# EAGLE design motorcontrol (EAGLE 9.6.2)

## Sheet 1 of 2: Logic for motor control.
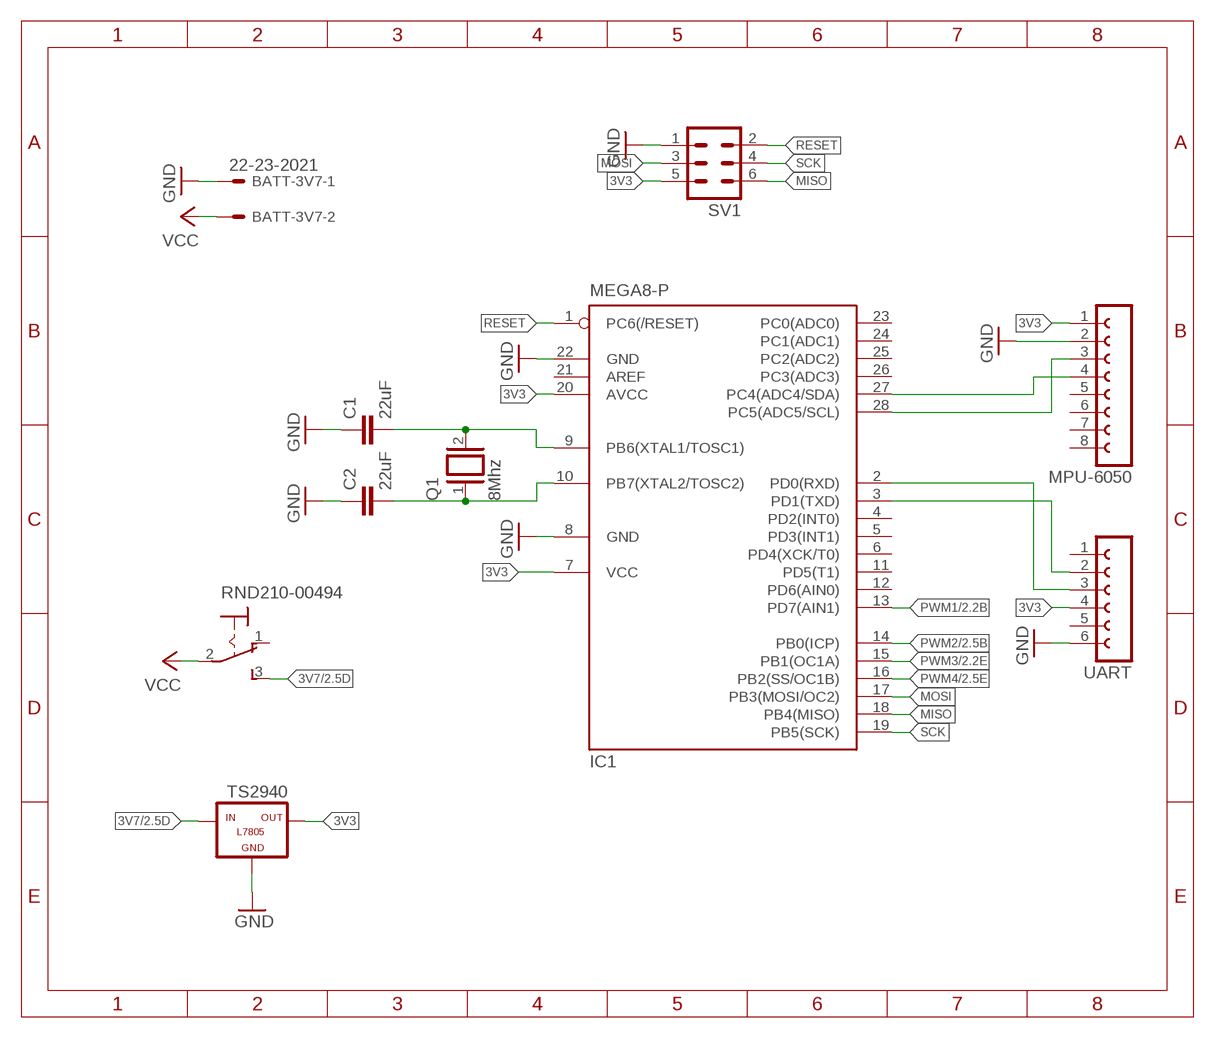
[diagram p0: schematic, sheet 1]

### Parts
BATT-3V7  22-23-2021  [22-23-2021]
C1  22uF  C-EU025-025X050  [C025-025X050]
C2  22uF  C-EU025-025X050  [C025-025X050]
IC1  MEGA8-P  [DIL28-3]
MPU-6050  FE08-1  [FE08]
Q1  8Mhz  XTAL/S  [QS]
RND210-00494  320-916  [320-916]
SV1  MA03-2  [MA03-2]
TS2940  TS2940  [TO220]
UART  FE06-1  [FE06]

### Nets
3V3: IC1.7(VCC) IC1.20(AVCC) MPU-6050.1 SV1.5 TS2940.3(OUT) UART.4
3V7 [Motor]: RND210-00494.3(S) TS2940.1(IN) ; also sheet 2
GND [Motor]: BATT-3V7.1 C1.1 C2.1 IC1.8(GND) IC1.22(GND) MPU-6050.2 SV1.1 TS2940.2(GND) UART.6 ; also sheet 2
MISO: IC1.18(PB4(MISO)) SV1.6
MOSI: IC1.17(PB3(MOSI/OC2)) SV1.3
N$1: C2.2 IC1.10(PB7(XTAL2/TOSC2)) Q1.1
N$2: C1.2 IC1.9(PB6(XTAL1/TOSC1)) Q1.2
N$3: IC1.28(PC5(ADC5/SCL)) MPU-6050.3
N$4: IC1.27(PC4(ADC4/SDA)) MPU-6050.4
N$5: IC1.3(PD1(TXD)) UART.2
N$6: IC1.2(PD0(RXD)) UART.3
PWM1: IC1.13(PD7(AIN1)) ; also sheet 2
PWM2: IC1.14(PB0(ICP)) ; also sheet 2
PWM3: IC1.15(PB1(OC1A)) ; also sheet 2
PWM4: IC1.16(PB2(SS/OC1B)) ; also sheet 2
RESET: IC1.1(PC6(/RESET)) SV1.2
SCK: IC1.19(PB5(SCK)) SV1.4
VCC: BATT-3V7.2 RND210-00494.2(P)
Unconnected: IC1.4(PD2(INT0)) IC1.5(PD3(INT1)) IC1.6(PD4(XCK/T0)) IC1.11(PD5(T1)) IC1.12(PD6(AIN0)) IC1.21(AREF) IC1.23(PC0(ADC0)) IC1.24(PC1(ADC1)) IC1.25(PC2(ADC2)) IC1.26(PC3(ADC3)) MPU-6050.5 MPU-6050.6 MPU-6050.7 MPU-6050.8 RND210-00494.1(O) UART.1 UART.5

## Sheet 2 of 2: Brush motor circuit.
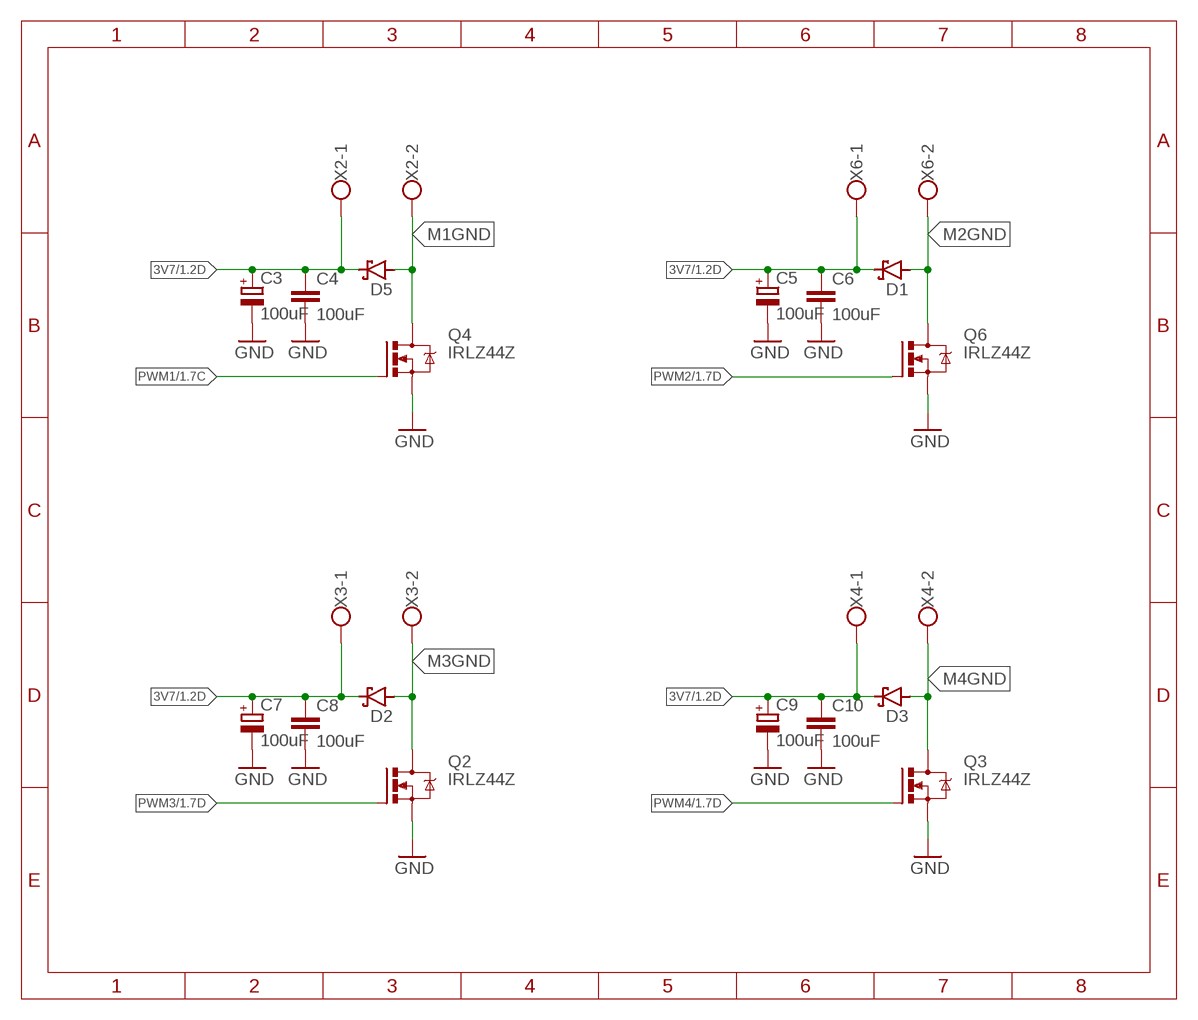
[diagram p1: schematic, sheet 2]

### Parts
C3  100uF  CPOL-EUE2-5  [E2-5]
C4  100uF  C-EU025-025X050  [C025-025X050]
C5  100uF  CPOL-EUE2-5  [E2-5]
C6  100uF  C-EU025-025X050  [C025-025X050]
C7  100uF  CPOL-EUE2-5  [E2-5]
C8  100uF  C-EU025-025X050  [C025-025X050]
C9  100uF  CPOL-EUE2-5  [E2-5]
C10  100uF  C-EU025-025X050  [C025-025X050]
D1  SCHOTTKY-DIODEDO201T15  [DO201T15]
D2  SCHOTTKY-DIODEDO201T15  [DO201T15]
D3  SCHOTTKY-DIODEDO201T15  [DO201T15]
D5  SCHOTTKY-DIODEDO201T15  [DO201T15]
Q2  IRLZ44Z  [TO220BH]
Q3  IRLZ44Z  [TO220BH]
Q4  IRLZ44Z  [TO220BH]
Q6  IRLZ44Z  [TO220BH]
X2  W237-102  [W237-102]
X3  W237-102  [W237-102]
X4  W237-102  [W237-102]
X6  W237-102  [W237-102]

### Nets
3V7 [Motor]: C3.+ C4.1 C5.+ C6.1 C7.+ C8.1 C9.+ C10.1 D1.C D2.C D3.C D5.C X2.1 X3.1 X4.1 X6.1 ; also sheet 1
GND [Motor]: C3.- C4.2 C5.- C6.2 C7.- C8.2 C9.- C10.2 Q2.S Q3.S Q4.S Q6.S ; also sheet 1
M1GND [Motor]: D5.A Q4.D X2.2
M2GND [Motor]: D1.A Q6.D X6.2
M3GND [Motor]: D2.A Q2.D X3.2
M4GND [Motor]: D3.A Q3.D X4.2
PWM1: Q4.G ; also sheet 1
PWM2: Q6.G ; also sheet 1
PWM3: Q2.G ; also sheet 1
PWM4: Q3.G ; also sheet 1

## Library data of the parts
BATT-3V7 = con-molex:22-23-2021: .100" (2.54mm) Center Header - 2 Pin; MF: MOLEX; MPN: 22-23-2021; OC_FARNELL: 1462926; OC_NEWARK: 25C3832
C1 C2 C4 C6 C8 C10 = rcl:C-EU: CAPACITOR, European symbol; SPICEPREFIX: C
C3 C5 C7 C9 = rcl:CPOL-EU: POLARIZED CAPACITOR, European symbol; SPICEPREFIX: C
D1-D3 D5 = diode:SCHOTTKY-DIODE: Schottky Diode
IC1 = atmel:MEGA8-P: MICROCONTROLLER 8 Kbytes FLASH, 1 kbytes SRAM, 512 bytes EEPROM, USART, 4-channel 10 bit ADC, 2-channel 8 bit ADC Pin compatible with Atmega48, ATMega88, ATMega168 Source: avr.lbr; OC_FARNELL: unknown; OC_NEWARK: unknown
MPU-6050 = con-lsta:FE08-1: FEMALE HEADER; OC_FARNELL: unknown; OC_NEWARK: unknown
Q1 = special:XTAL/S: CRYSTAL
Q2-Q4 Q6 = transistor-power:IRLZ44Z: N-Channel HEXFET® Power MOSFET Logic Level AUTOMOTIVE MOSFET Source: http://www.irf.com/product-info/datasheets/data/irlz44zpbf.pdf
RND210-00494 = switch:320-916: TOGGLE SWITCH distributor RS Components
SV1 = con-lstb:MA03-2: PIN HEADER; OC_FARNELL: unknown; OC_NEWARK: unknown
TS2940 = TS2940:TS2940: VOLTAGE REGULATOR
UART = con-lsta:FE06-1: FEMALE HEADER; OC_FARNELL: unknown; OC_NEWARK: unknown
X2-X4 X6 = con-wago-500:W237-102: WAGO SCREW CLAMP; MPN: 237-102; OC_FARNELL: unknown; OC_NEWARK: 70K9898

## Net classes
0 default: width 0.508 mm, drill 0.254 mm, clearance 0.254 mm
1 Motor: width 2.261 mm, drill 0.889 mm, clearance 0.889 mm

## Board
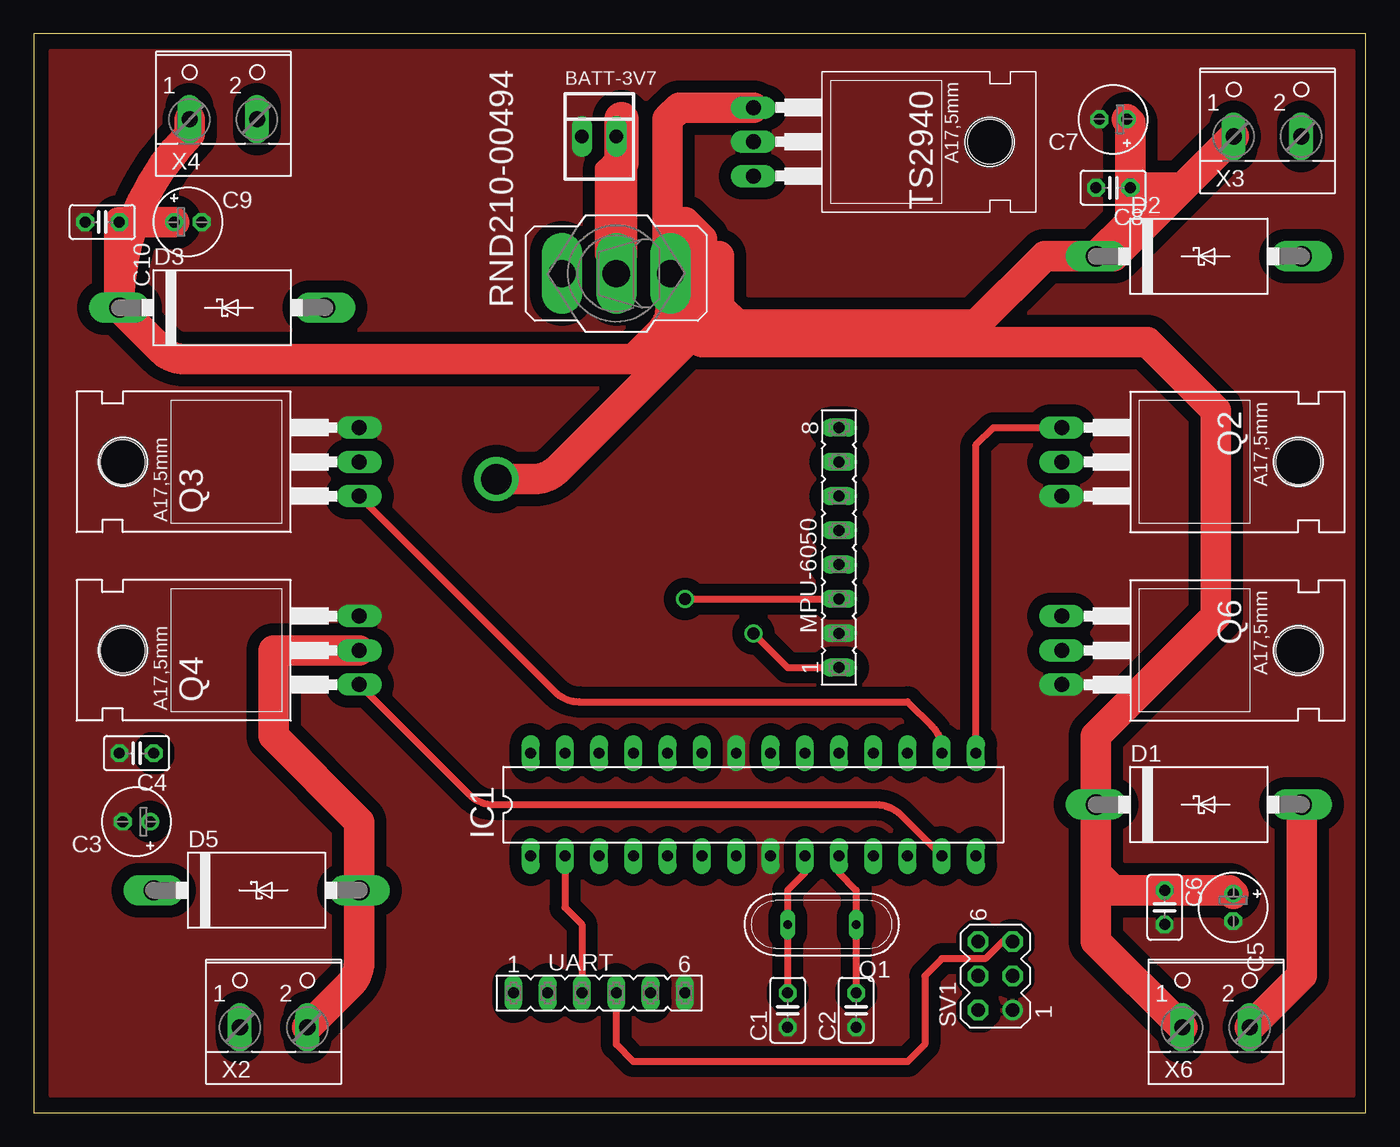
[diagram p2: board, top side]
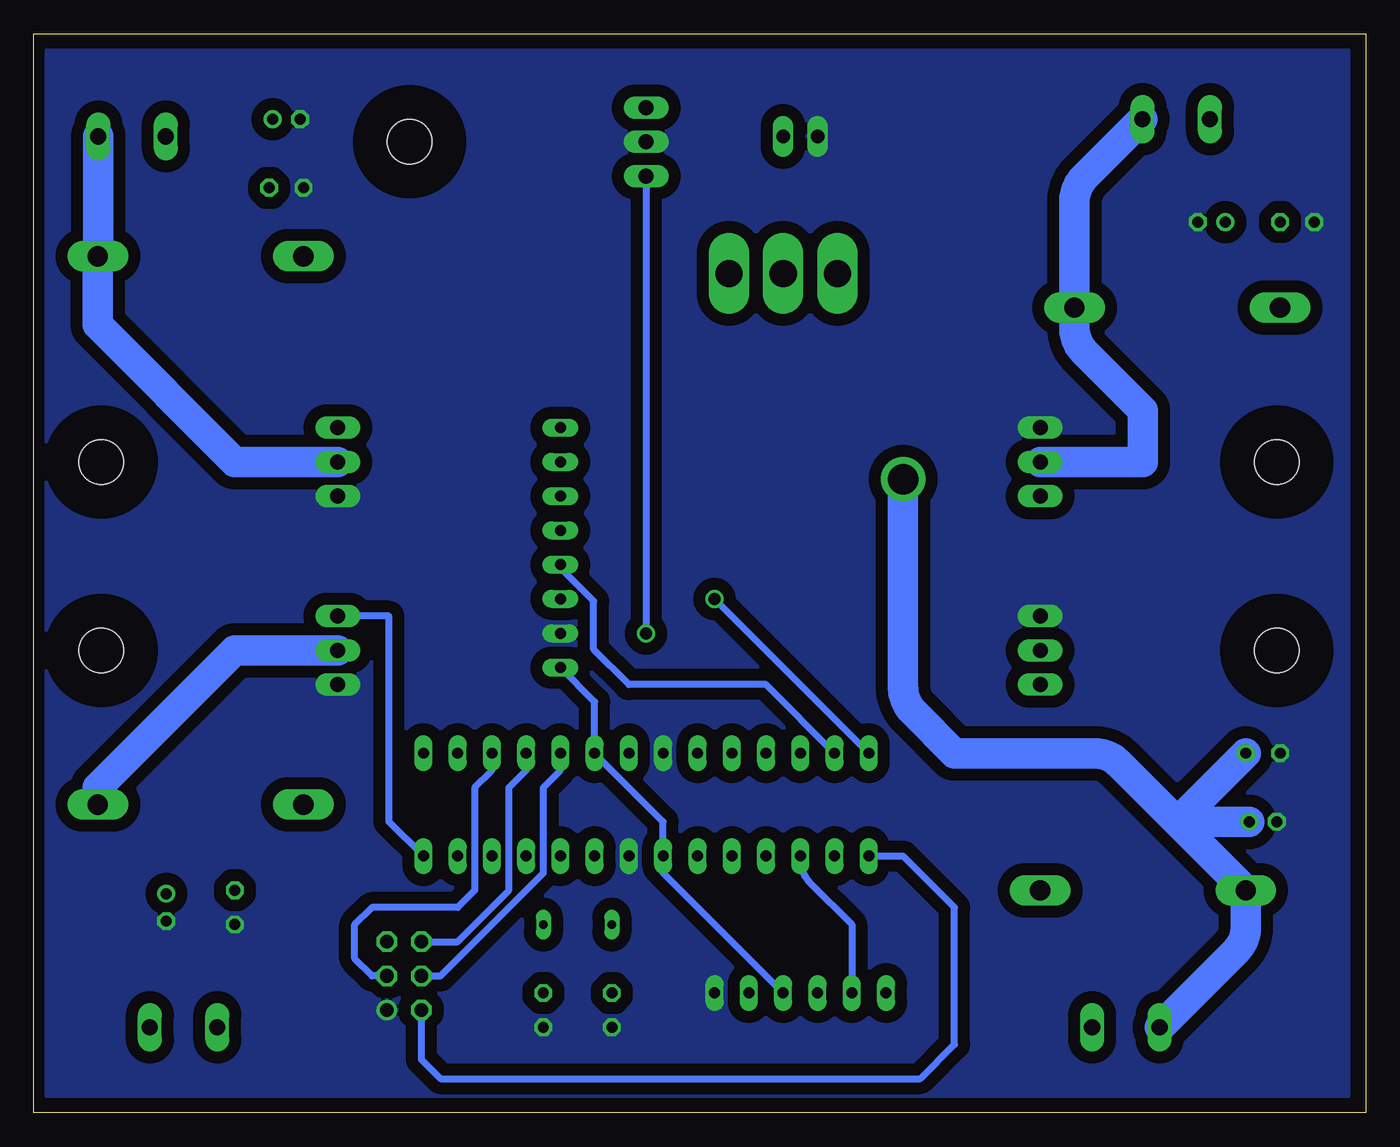
[diagram p3: board, bottom side, seen from below]

Size 98.73 x 80 mm. Coordinates in mm from the lower left corner, seen from the top.
Outline: 0,0 98.73,0 98.73,80 0,80 0,0
Copper layers (1*16): Top 0.035mm / dielectric 1.5mm / Bottom 0.035mm
Design rules "default *": minimum track width 6mil, minimum drill 0.35mm, track to track 10mil, track to pad 10mil, pad to pad 10mil, via to via 10mil, smd to smd 0mil, copper to edge 10mil, drill to drill 6mil, minimum pad ring 10mil, minimum via ring 8mil, stop-mask expansion 4mil, vias tented up to drill 0mil, thermal gap 0mil

### Footprints (pad centres in the part's own frame; a part is rotated, then mirrored left to right if it is on the bottom)
22-23-2021 = drill 1 long: 1 -1.27,0; 2 1.27,0
C025-025X050 = drill 0.813 octagon: 1 -1.27,0; 2 1.27,0
E2-5 = drill 0.813 pad 1.27: + -1.016,0 | drill 0.813 pad 1.27 octagon: - 1.016,0
DO201T15 = drill 1.499 long: A 7.62,0; C -7.62,0
DIL28-3 = drill 0.813 long: 1 -16.51,-3.81; 2 -13.97,-3.81; 3 -11.43,-3.81; 4 -8.89,-3.81; 5 -6.35,-3.81; 6 -3.81,-3.81; 7 -1.27,-3.81; 8 1.27,-3.81; 9 3.81,-3.81; 10 6.35,-3.81; 11 8.89,-3.81; 12 11.43,-3.81; 13 13.97,-3.81; 14 16.51,-3.81; 15 16.51,3.81; 16 13.97,3.81; 17 11.43,3.81; 18 8.89,3.81; 19 6.35,3.81; 20 3.81,3.81; 21 1.27,3.81; 22 -1.27,3.81; 23 -3.81,3.81; 24 -6.35,3.81; 25 -8.89,3.81; 26 -11.43,3.81; 27 -13.97,3.81; 28 -16.51,3.81
FE08 = drill 0.813 long: 1 -8.89,0; 2 -6.35,0; 3 -3.81,0; 4 -1.27,0; 5 1.27,0; 6 3.81,0; 7 6.35,0; 8 8.89,0
QS = drill 0.61 long: 1 -2.54,0; 2 2.54,0
TO220BH = drill 1.118 long: D 0,-6.35; G -2.54,-6.35; S 2.54,-6.35 | hole 3.302: 0,11.176
320-916 = drill 2.007 long: 1 0,4.013; 2 0,0; 3 0,-4.013
MA03-2 = drill 1.016: 1 -2.54,-1.27 | drill 1.016 octagon: 2 -2.54,1.27; 3 0,-1.27; 4 0,1.27; 5 2.54,-1.27; 6 2.54,1.27
TO220 = drill 1.118 long: 1 -2.54,-6.35; 2 0,-6.35; 3 2.54,-6.35 | hole 3.302: 0,11.176
FE06 = drill 0.813 long: 1 -6.35,0; 2 -3.81,0; 3 -1.27,0; 4 1.27,0; 5 3.81,0; 6 6.35,0
W237-102 = drill 1.194 long: 1 -2.5,-1.27; 2 2.5,-1.27

### Placement (x,y rotation side)
BATT-3V7  41.91,72.39 0 top
C1  55.88,7.62 90 top
C2  60.96,7.62 90 top
C3  7.62,21.59 180 top
C4  7.62,26.67 180 top
C5  88.9,15.24 270 top
C6  83.82,15.24 270 top
C7  80.01,73.66 180 top
C8  80.01,68.58 180 top
C9  11.43,66.04 0 top
C10  5.08,66.04 180 top
D1  86.36,22.86 0 top
D2  86.36,63.5 0 top
D3  13.97,59.69 0 top
D5  16.51,16.51 0 top
IC1  53.34,22.86 0 top
MPU-6050  59.69,41.91 90 top
Q1  58.42,13.97 180 top
Q2  82.55,48.26 270 top
Q3  17.78,48.26 90 top
Q4  17.78,34.29 90 top
Q6  82.55,34.29 270 top
RND210-00494  43.18,62.23 90 top
SV1  71.28,10.16 90 top
TS2940  59.69,71.99 270 top
UART  41.91,8.89 0 top
X2  17.78,7.62 0 top
X3  91.44,73.66 0 top
X4  14.05,74.93 0 top
X6  87.63,7.62 0 top

### Tracks (layer width: path | path; a pad name or v marks a point on that pad's centre or on a via)
3V3  (via drill 0.89)
  Top 0.508: SV1.5 71.81,12.7 70.54,11.43 67.31,11.43 66.04,10.16 66.04,5.08 64.77,3.81 44.45,3.81 43.18,5.08 UART.4 | v53.34,35.56 55.88,33.02 MPU-6050.1
  Bottom 0.508: UART.4 52.07,17.78 IC1.7 52.07,21.59 IC1.20 57.15,30.48 MPU-6050.1 | TS2940.3 v53.34,35.56
3V7  (via drill 2.26)
  Top 2.261: X4.1 11.55,72.56 arc45 6.35,60.01 | 6.35,60.01 D3.C 9.42,56.62 arc45 11.21,55.88 44.45,55.88 46.45,57.88 arc45 47.19,59.67 RND210-00494.3 | v34.29,46.99 37.05,46.99 arc45 38.84,47.73 48.26,57.15 48.26,63.5 46.99,64.77 | TS2940.1 47.86,74.53 46.99,73.66 46.99,66.04 | 46.99,66.04 46.99,64.77 | 46.99,64.77 46.99,62.43 | 46.99,62.43 RND210-00494.3 | X6.1 78.74,12.74 D1.C | 49.53,63.5 49.53,57.15 82.55,57.15 87.63,52.07 87.63,48.26 87.63,36.83 78.74,27.94 D1.C | 49.53,63.5 49.53,64.77 48.26,66.04 46.99,66.04 | X3.1 85.11,68.56 | D2.C 80.05,63.5 85.11,68.56 | D2.C 74.93,63.5 69.85,58.42 52.07,58.42 50.8,59.69 50.8,63.5 48.46,63.5 RND210-00494.3 | C9.+ C10.1 6.35,60.01 | C7.+ 81.28,73.41 C8.1 | 83.84,68.56 85.11,68.56 | C5.+ 88.65,16.51 C6.1 80.01,16.51 78.74,17.78 D1.C | C8.1 85.09,68.58 85.11,68.56 | C8.1 81.28,66.04 D2.C | 49.53,63.5 48.46,62.43 46.99,62.43
  Bottom 2.261: X2.1 9.63,12 arc-45 8.89,13.79 D5.C 13.97,21.59 | 13.97,21.59 18.31,25.93 arc-45 20.1,26.67 30.48,26.67 33.55,29.74 arc45 34.29,31.53 v34.29,46.99 | C3.+ 13.97,21.59 | C4.1 13.97,21.59
GND
  pour Top: 1.27,78.74 97.79,78.74 97.79,1.27 1.27,1.27
  pour Bottom: 1.27,78.74 97.79,78.74 97.79,1.27 1.27,1.27
M1GND
  Top 2.261: X2.2 23.39,9.46 arc45 24.13,11.25 D5.A 24.13,21.59 17.78,27.94 17.78,34.29 Q4.D
M2GND
  Top 2.261: X6.2 93.98,10.2 D1.A
  Bottom 2.261: D1.A 93.98,24.13 83.82,34.29 Q6.D
M3GND
  Bottom 2.261: X3.2 93.94,63.54 D2.A 93.98,58.42 83.82,48.26 Q2.D
M4GND
  Bottom 2.261: X4.2 20.85,69.36 arc-45 21.59,67.57 D3.A 21.59,58.2 arc-45 20.85,56.41 16.51,52.07 16.51,48.26 Q3.D
MISO
  Bottom 0.508: SV1.6 67.31,12.7 63.5,16.51 63.5,24.13 62.23,25.4 IC1.18
MOSI
  Bottom 0.508: IC1.17 64.77,25.4 66.04,24.13 66.04,16.51 67.31,15.24 73.66,15.24 74.93,13.97 74.93,11.43 73.66,10.16 SV1.3
N$1
  Top 0.508: IC1.10 59.69,17.78 60.96,16.51 Q1.1 C2.2
N$2
  Top 0.508: IC1.9 57.15,17.78 55.88,16.51 Q1.2 C1.2
N$3  (via drill 0.89)
  Top 0.508: v48.26,38.1 MPU-6050.3
  Bottom 0.508: IC1.28 v48.26,38.1
N$4
  Bottom 0.508: IC1.27 44.45,31.75 54.61,31.75 57.23,34.37 57.23,37.95 59.69,40.41 MPU-6050.4
N$5
  Bottom 0.508: IC1.3 41.91,18.83 arc-45 41.17,17.04 38.1,13.97 UART.2
N$6
  Top 0.508: IC1.2 39.37,15.24 40.64,13.97 UART.3
PWM1
  Top 0.508: Q4.G 32.28,23.6 arc45 34.07,22.86 62.45,22.86 arc-45 64.24,22.12 IC1.13
PWM2
  Bottom 0.508: IC1.14 72.39,21.59 72.39,36.83 Q6.G
PWM3
  Top 0.508: IC1.15 69.85,49.53 71.12,50.8 Q2.G
PWM4
  Top 0.508: Q3.G 38.63,31.22 arc45 40.42,30.48 64.77,30.48 66.57,28.68 arc-45 67.31,26.89 IC1.16
RESET
  Bottom 0.508: IC1.1 34.29,19.05 30.48,15.24 30.48,5.08 33.02,2.54 68.58,2.54 70.01,3.97 SV1.2
SCK
  Bottom 0.508: SV1.4 68.58,10.16 60.96,17.78 60.96,24.13 59.69,25.4 IC1.19
VCC
  Top 0.61: BATT-3V7.2 42.59,71.8 42.59,70.83 41.91,70.15 41.91,63.5 RND210-00494.2 44.45,63.5 44.45,67.31 44.45,69.85
  Top 2.54: RND210-00494.2 43.18,70.06 43.55,70.43 43.55,73.66